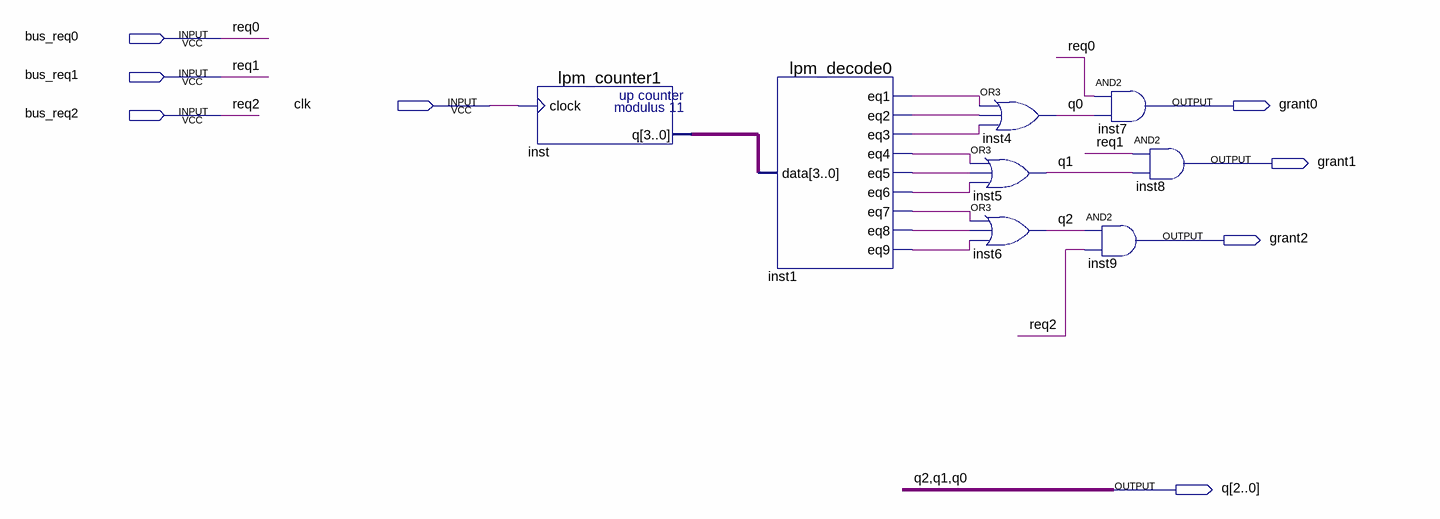
[diagram p0: schematic sheet]
// Quartus schematic central_arbiter.bdf as structural Verilog: 8 symbols, 8 pins
module central_arbiter (
  input  bus_req0,
  input  bus_req1,
  input  clk,
  input  bus_req2,
  output grant0,
  output grant1,
  output grant2,
  output [2:0] q
);

  wire inst1_eq1, inst1_eq2, inst1_eq3, inst1_eq4, inst1_eq5, inst1_eq6, inst1_eq7, inst1_eq8, inst1_eq9;
  wire [3:0] inst_q;

  lpm_counter1 inst (.clock(clk), .q(inst_q));
  lpm_decode0 inst1 (
    .data(inst_q), .eq1(inst1_eq1), .eq2(inst1_eq2), .eq3(inst1_eq3), .eq4(inst1_eq4), .eq5(inst1_eq5),
    .eq6(inst1_eq6), .eq7(inst1_eq7), .eq8(inst1_eq8), .eq9(inst1_eq9));
  or inst4 (q[0], inst1_eq1, inst1_eq2, inst1_eq3);
  or inst5 (q[1], inst1_eq4, inst1_eq5, inst1_eq6);
  or inst6 (q[2], inst1_eq7, inst1_eq8, inst1_eq9);
  and inst7 (grant0, bus_req0, q[0]);
  and inst8 (grant1, bus_req1, q[1]);
  and inst9 (grant2, q[2], bus_req2);

  // Other names for the same wires on the sheet: req0 = bus_req0; req1 = bus_req1; req2 = bus_req2
endmodule
